# Altium schematic sheet 04 外部接口.SchDoc
size A4
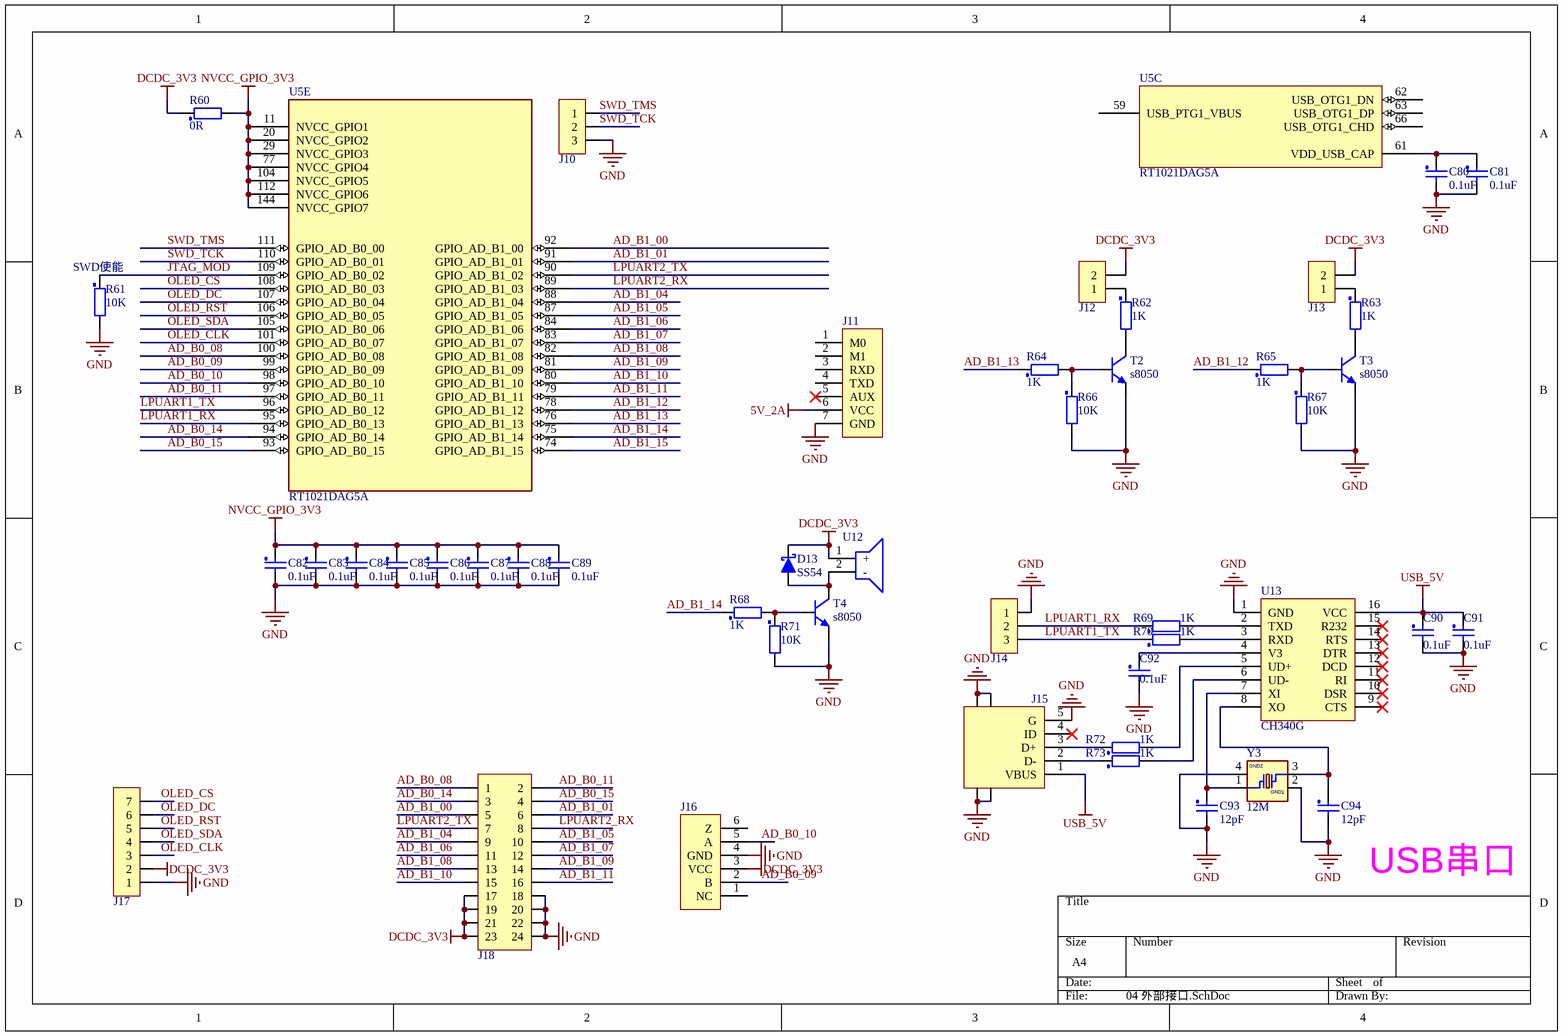
[diagram p0: 04 外部接口.SchDoc]

## Parts
C80  0.1uF  [cap0603]
C81  0.1uF  [cap0603]
C82  0.1uF  [cap0603]
C83  0.1uF  [cap0603]
C84  0.1uF  [cap0603]
C85  0.1uF  [cap0603]
C86  0.1uF  [cap0603]
C87  0.1uF  [cap0603]
C88  0.1uF  [cap0603]
C89  0.1uF  [cap0603]
C90  0.1uF  [cap0603]
C91  0.1uF  [cap0603]
C92  0.1uF  [cap0603]
C93  12pF  [cap0603]
C94  12pF  [cap0603]
D13  SS54  [SMA(DO-214AC)]
J10  1X3  [HDR-1X3_SWD]  (value not drawn)
J11  1x7m  [uart_nrf24l01]  (value not drawn)
J12  1x2  [HDR-1X2]  (value not drawn)
J13  1x2  [HDR-1X2]  (value not drawn)
J14  1X3  [HDR-1X3]  (value not drawn)
J15  USB_micro_b  [USB_micro_b]  (value not drawn)
J16  2x3  [LQ256Encoder]  (value not drawn)
J17  1X5m  [LQ_OLED128X64去丝印]  (value not drawn)
J18  2x12  [HDR-2x12]  (value not drawn)
R60  0R  [res0603]
R61  10K  [res0603]
R62  1K  [res0603]
R63  1K  [res0603]
R64  1K  [res0603]
R65  1K  [res0603]
R66  10K  [res0603]
R67  10K  [res0603]
R68  1K  [res0603]
R69  1K  [res0603]
R70  1K  [res0603]
R71  10K  [res0603]
R72  1K  [res0603]
R73  1K  [res0603]
T2  s8050  [SOT-23-3]
T3  s8050  [SOT-23-3]
T4  s8050  [SOT-23-3]
U5  RT1021DAG5A  [LQFP144_0P5_20X20MM]  (parts C,E of 6)
U12  beep  [beep]  (value not drawn)
U13  CH340G  [SOP-16_150mil]
Y3  12M  [SMD3225]

## Nets
5V_2A: J11.6(VCC)
DCDC_3V3: D13.2(K) J12.2 J13.2 J16.3(VCC) J17.2 J18.17 J18.19 J18.21 J18.23 R60.1 U12.1(+)
GND: C80.2 C81.2 C82.2 C83.2 C84.2 C85.2 C86.2 C87.2 C88.2 C89.2 C90.2 C91.2 C92.2 C93.2 C94.2 J10.3 J11.7(GND) J14.1 J15.5(G) J15.6 J15.7 J15.8 J15.9 J16.4(GND) J17.1 J18.18 J18.20 J18.22 J18.24 R61.2 R66.2 R67.2 R71.2 T2.2(E) T3.2(E) T4.2(E) U13.1(GND) Y3.2(GND1) Y3.4(GND2)
NVCC_GPIO_3V3: C82.1 C83.1 C84.1 C85.1 C86.1 C87.1 C88.1 C89.1 R60.2 U5.11(NVCC_GPIO1) U5.20(NVCC_GPIO2) U5.29(NVCC_GPIO3) U5.77(NVCC_GPIO4) U5.104(NVCC_GPIO5) U5.112(NVCC_GPIO6) U5.144(NVCC_GPIO7)
USB_5V: C90.1 C91.1 J15.1(VBUS) U13.16(VCC)
AD_B0_08: J18.1 U5.100(GPIO_AD_B0_08)
AD_B0_09: J16.2(B) U5.99(GPIO_AD_B0_09)
AD_B0_10: J16.5(A) U5.98(GPIO_AD_B0_10)
AD_B0_11: J18.2 U5.97(GPIO_AD_B0_11)
AD_B0_14: J18.3 U5.94(GPIO_AD_B0_14)
AD_B0_15: J18.4 U5.93(GPIO_AD_B0_15)
AD_B1_00: J18.5 U5.92(GPIO_AD_B1_00)
AD_B1_01: J18.6 U5.91(GPIO_AD_B1_01)
AD_B1_04: J18.9 U5.88(GPIO_AD_B1_04)
AD_B1_05: J18.10 U5.87(GPIO_AD_B1_05)
AD_B1_06: J18.11 U5.84(GPIO_AD_B1_06)
AD_B1_07: J18.12 U5.83(GPIO_AD_B1_07)
AD_B1_08: J18.13 U5.82(GPIO_AD_B1_08)
AD_B1_09: J18.14 U5.81(GPIO_AD_B1_09)
AD_B1_10: J18.15 U5.80(GPIO_AD_B1_10)
AD_B1_11: J18.16 U5.79(GPIO_AD_B1_11)
AD_B1_12: R65.1 U5.78(GPIO_AD_B1_12)
AD_B1_13: R64.1 U5.76(GPIO_AD_B1_13)
AD_B1_14: R68.1 U5.75(GPIO_AD_B1_14)
AD_B1_15: U5.74(GPIO_AD_B1_15)
JTAG_MOD: R61.1 U5.109(GPIO_AD_B0_02)
LPUART1_RX: J14.2 R69.1 U5.95(GPIO_AD_B0_13)
LPUART1_TX: J14.3 R70.1 U5.96(GPIO_AD_B0_12)
LPUART2_RX: J18.8 U5.89(GPIO_AD_B1_03)
LPUART2_TX: J18.7 U5.90(GPIO_AD_B1_02)
OLED_CLK: J17.3 U5.101(GPIO_AD_B0_07)
OLED_CS: J17.7 U5.108(GPIO_AD_B0_03)
OLED_DC: J17.6 U5.107(GPIO_AD_B0_04)
OLED_RST: J17.5 U5.106(GPIO_AD_B0_05)
OLED_SDA: J17.4 U5.105(GPIO_AD_B0_06)
SWD_TCK: J10.2 U5.110(GPIO_AD_B0_01)
SWD_TMS: J10.1 U5.111(GPIO_AD_B0_00)
NetC80_1: C80.1 C81.1 U5.61(VDD_USB_CAP)
NetC92_1: C92.1 U13.4(V3)
NetC93_1: C93.1 U13.7(XI) Y3.1
NetC94_1: C94.1 U13.8(XO) Y3.3
NetD13_1: D13.1(A) T4.3(C) U12.2(-)
NetJ12_1: J12.1 R62.1
NetJ13_1: J13.1 R63.1
NetJ15_2: J15.2(D-) R73.1
NetJ15_3: J15.3(D+) R72.1
NetR62_2: R62.2 T2.3(C)
NetR63_2: R63.2 T3.3(C)
NetR64_2: R64.2 R66.1 T2.1(B)
NetR65_2: R65.2 R67.1 T3.1(B)
NetR68_2: R68.2 R71.1 T4.1(B)
NetR69_2: R69.2 U13.2(TXD)
NetR70_2: R70.2 U13.3(RXD)
NetR72_2: R72.2 U13.5(UD+)
NetR73_2: R73.2 U13.6(UD-)

Not connected (* = marked no-connect by the designer): J11 1(M0) 2(M1) 3(RXD) 4(TXD) 5(AUX)*; J15 4(ID)*; J16 1(NC) 6(Z); U5 59(USB_PTG1_VBUS) 62(USB_OTG1_DN) 63(USB_OTG1_DP) 66(USB_OTG1_CHD); U13 9(CTS)* 10(DSR)* 11(RI)* 12(DCD)* 13(DTR)* 14(RTS)* 15(R232)*

## Notes on the sheet
- (near R61) SWD使能
- (near C94) USB串口

## Library data of the parts
C80-C94 = Cap: 贴片电容; Published: 8-Jun-2000; LatestRevisionDate: 17-Jul-2002; LatestRevisionNote: Re-released for DXP Platform.; PackageReference: RAD-0.3; Publisher: Altium Limited
  C80-C92: Value: 0.1uF
  C93 C94: Value: 12pF
D13 = D Schottky: 肖特基二极管; Published: 8-Jun-2000; LatestRevisionDate: 17-Jul-2002; LatestRevisionNote: Re-released for DXP Platform.; PackageReference: SMB; Publisher: Altium Limited; Code_JEDEC: DO-214-AA
J10 J14 = Header 3: 2.54mm公排针; BOM名称: 3P接插件; 版权归属: 源创客; 学习资源: www.ooocke.com
J11 = 无线串口模块: 2.54mm母排座 /
J12 J13 = Header 2: 2.54mm公排针; BOM名称: 2P接插件; 版权归属: 源创客; 学习资源: www.ooocke.com
J15 = USB_micro_b: microUSB母座,立创商城C404969
J16 = LQ_AB256: 2.54mm公排针
J17 = Header 7: 2.54mm母排座; BOM名称: 5P接插件; 版权归属: 源创客; 学习资源: www.ooocke.com
J18 = Header 12*2: 2.54mm公排针; BOM名称: 5P接插件; 版权归属: 源创客; 学习资源: www.ooocke.com
R60-R73 = Res: 贴片电阻; Published: 8-Jun-2000; LatestRevisionDate: 17-Jul-2002; LatestRevisionNote: Re-released for DXP Platform.; PackageReference: AXIAL-0.4; Publisher: Altium Limited
  R60: Value: 0R
  R61 R66 R67 R71: Value: 10K
  R62-R65 R68-R70 R72 R73: Value: 1K
T2-T4 = s8050: 贴片三极管 NPN管
U5 = RT1021DAG5A: Cortex-M7 500MHZ 1.3V; ASSY_OPT: *; CLASS: *; SPLIT_INST: *; SWAP_INFO: *; AGILE_PN: *; MFG_NAME01: *; MFG_PN01: *; ROHS: *; Temp_Range: *; PRE_APN: *; CAD_APPROVED: *; HEIGHT: *; SILK: *
U12 = beep: 有源蜂鸣器，3V，直径9mm引脚间距5mm
U13 = CH340G: USB转串口芯片
Y3 = CRYSTAL_JXS63: 无源晶振 12MHZ 12pF 3.2X2.5MM SMD; CLASS: *; HEIGHT: *; CAD_APPROVED: *; ASSY_OPT: *; PRE_APN: *; ICA_MFR_NAME: *; ICA_PARTNUM: *; ROHS: *; MFG_PN01: *; MFG_NAME01: *; AGILE_PN: *; Temp_Range: *